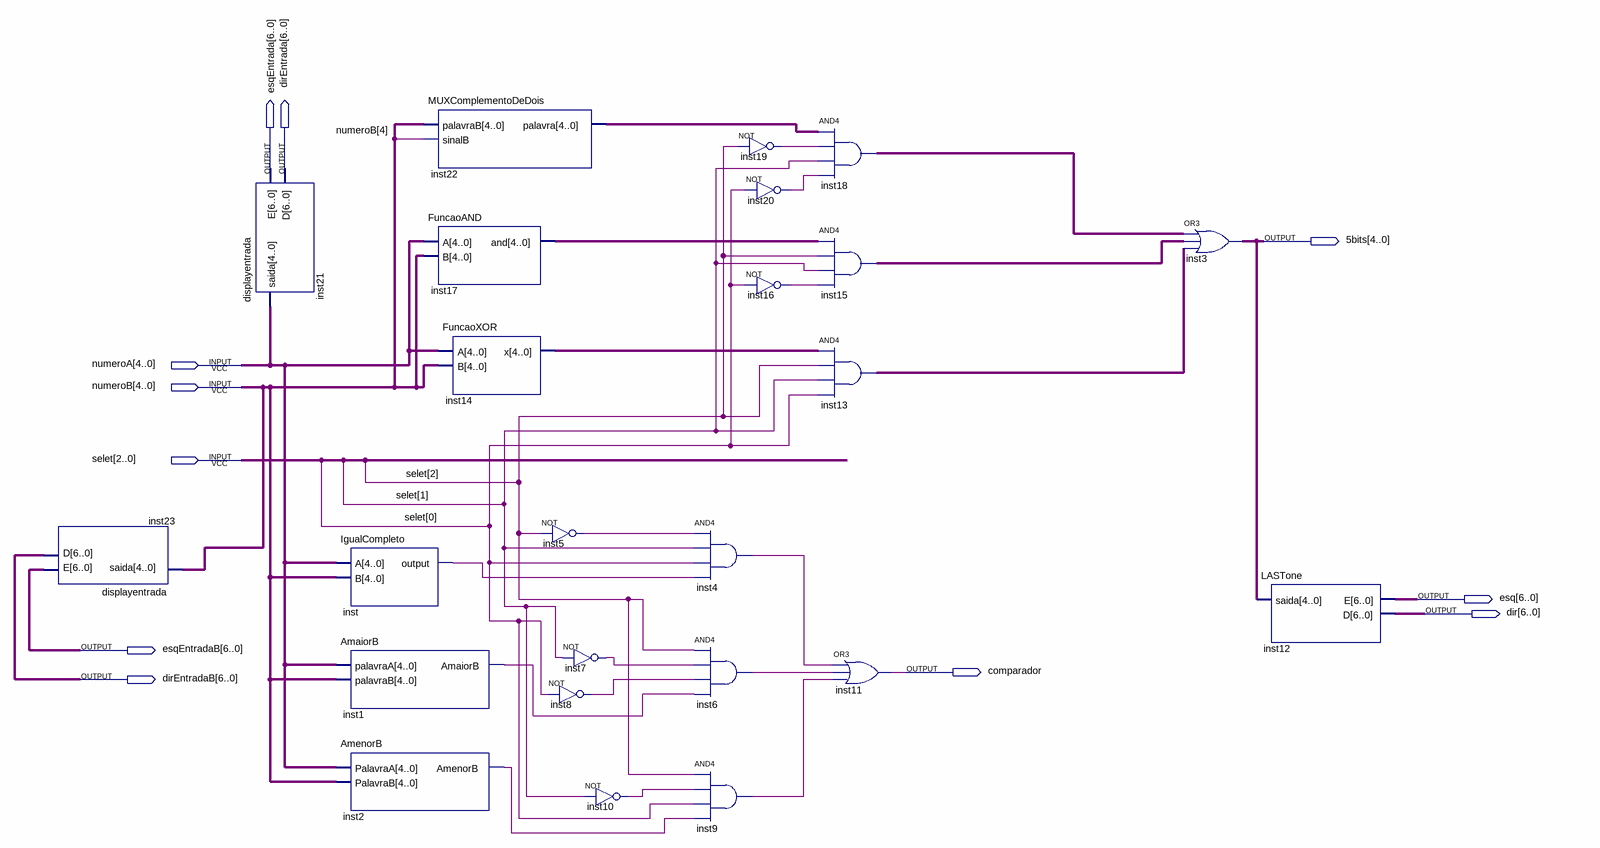
[diagram p0: schematic sheet]
// Quartus schematic MUX_ULA.bdf as structural Verilog: 24 symbols, 11 pins
module MUX_ULA (
  input  [4:0] numeroA,
  input  [4:0] numeroB,
  input  [2:0] selet,
  output [6:0] esqEntrada,
  output [6:0] dirEntrada,
  output [4:0] \5bits ,
  output [6:0] esq,
  output [6:0] dir,
  output [6:0] esqEntradaB,
  output comparador,
  output [6:0] dirEntradaB
);

  wire inst1_amaiorb, inst2_amenorb, inst4_out, inst5_out, inst6_out, inst7_out, inst8_out, inst9_out,
       inst10_out, inst16_out, inst19_out, inst20_out, inst_output;
  wire [4:0] inst13_out, inst14_x, inst15_out, inst17_and, inst18_out, inst22_palavra;

  displayentrada inst23 (.saida(numeroB), .E(esqEntradaB), .D(dirEntradaB));
  displayentrada inst21 (.saida(numeroA));  // open: E, D
  IgualCompleto inst (.A(numeroA), .B(numeroB), .\output (inst_output));
  AmaiorB inst1 (.palavraA(numeroA), .palavraB(numeroB), .AmaiorB(inst1_amaiorb));
  AmenorB inst2 (.PalavraA(numeroA), .PalavraB(numeroB), .AmenorB(inst2_amenorb));
  MUXComplementoDeDois inst22 (.palavraB(numeroB), .sinalB(numeroB[4]), .palavra(inst22_palavra));
  FuncaoAND inst17 (.A(numeroA), .B(numeroB), .\and (inst17_and));
  FuncaoXOR inst14 (.A(numeroA), .B(numeroB), .x(inst14_x));
  not inst5 (inst5_out, selet[2]);
  not inst7 (inst7_out, selet[1]);
  not inst8 (inst8_out, selet[0]);
  not inst10 (inst10_out, selet[1]);
  and inst4 (inst4_out, inst5_out, selet[1], selet[0], inst_output);
  and inst6 (inst6_out, selet[2], inst7_out, inst8_out, inst1_amaiorb);
  and inst9 (inst9_out, selet[2], inst10_out, selet[0], inst2_amenorb);
  not inst19 (inst19_out, selet[2]);
  not inst20 (inst20_out, selet[0]);
  not inst16 (inst16_out, selet[0]);
  assign inst18_out = inst22_palavra & {5{inst19_out}} & {5{selet[1]}} & {5{inst20_out}};  // AND4 inst18, 5 bits wide
  assign inst15_out = inst17_and & {5{selet[2]}} & {5{selet[1]}} & {5{inst16_out}};  // AND4 inst15, 5 bits wide
  assign inst13_out = inst14_x & {5{selet[2]}} & {5{selet[1]}} & {5{selet[0]}};  // AND4 inst13, 5 bits wide
  or inst11 (comparador, inst4_out, inst6_out, inst9_out);
  assign \5bits  = inst18_out | inst15_out | inst13_out;  // OR3 inst3, 5 bits wide
  LASTone inst12 (.saida(\5bits ), .E(esq), .D(dir));
endmodule
